# Altium schematic sheet Power Supplies.SchDoc: Power Supplies
size A4; SheetNumber: 5; SheetTotal: 5
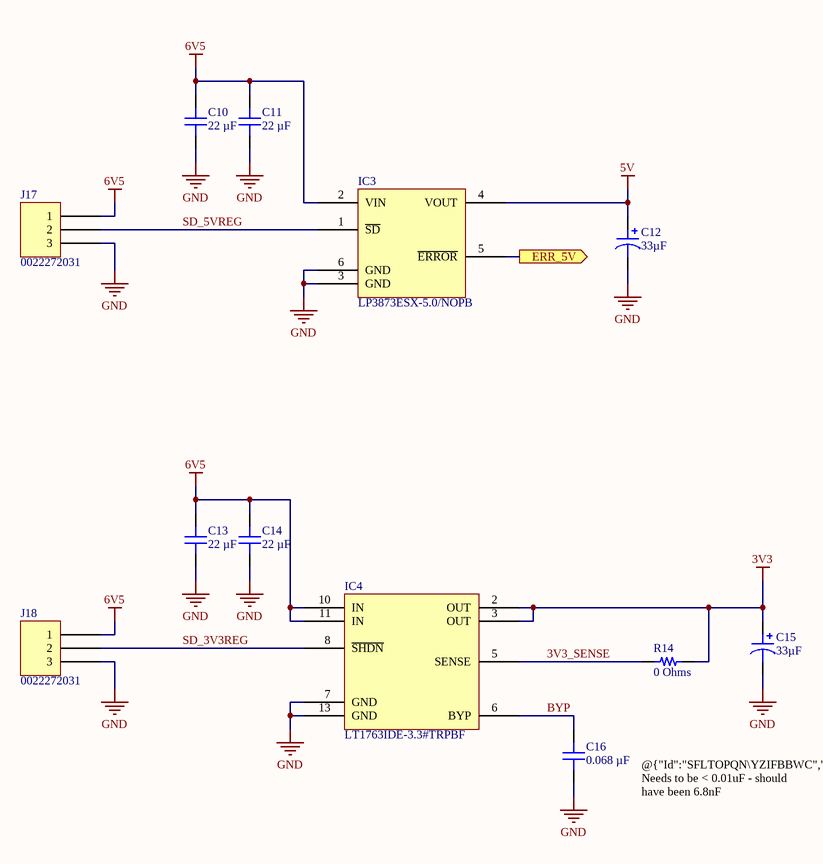
[diagram p0: Power Supplies.SchDoc]

## Parts
C10  22 µF  [CAP 1210_3225 - 1MM]
C11  22 µF  [CAP 1210_3225 - 1MM]
C12  33µF  [CAP POL 1411_3528]
C13  22 µF  [CAP 1210_3225 - 1MM]
C14  22 µF  [CAP 1210_3225 - 1MM]
C15  33µF  [CAP POL 1411_3528]
C16  0.068 µF  [CAP 0402_1005]
IC3  LP3873ESX-5.0/NOPB  [TI DDPAK-5 KTT R-PSFM-G5]
IC4  LT1763IDE-3.3#TRPBF  [ANALOG DFN-12 DE UE 05-08-1695 Rev D]
J17  0022272031  [MOLEX KK 0022272031]
J18  0022272031  [MOLEX KK 0022272031]
R14  0 Ohms  [RES 0603_1608]

## Ports
ERR_5V (out, see Overview[3D])

## Nets
3V3: C15.1 IC4.2(OUT) IC4.3(OUT) R14.1
5V: C12.1 IC3.4(VOUT)
6V5: C10.2 C11.2 C13.2 C14.2 IC3.2(VIN) IC4.10(IN) IC4.11(IN) J17.1 J18.1
GND: C10.1 C11.1 C12.2 C13.1 C14.1 C15.2 C16.1 IC3.3(GND) IC3.6(GND) IC4.7(GND) IC4.13(GND) J17.3 J18.3
3V3_SENSE: IC4.5(SENSE) R14.2
BYP: C16.2 IC4.6(BYP)
ERR_5V: IC3.5(~{ERROR}) ; port ERR_5V
SD_3V3REG: IC4.8(~{SHDN}) J18.2
SD_5VREG: IC3.1(~{SD}) J17.2

## Notes on the sheet
- @{"Id":"SFLTOPQN\YZIFBBWC","ObjectType":2} Needs to be < 0.01uF - should have been 6.8nF
- Title
- Size:
- Date:
- A4
- Number:
- Time:
- Revision:
- Sheet
- of
- File:

## Library data of the parts
C10 C11 C13 C14 = CL32B226KAJNNNE: CAP CER 22UF 25V X7R 1210; manufacturer: Samsung Electro-Mechanics; Tolerance: ±10%; Part Number: CL32B226KAJNNNE; Value: 22 µF; Applications: General Purpose; Capacitance: 22 µF; componentlink1description: Datasheet; componentlink1url: http://www.samsungsem.com/kr/support/product-search/mlcc/CL32B226KAJNNNE.jsp; componentlink2description: DigiKey Link; componentlink2url: https://www.digikey.com/en/products/detail/samsung-electro-mechanics/CL32B226KAJNNNE/3889050; Device Package: 1210 (3225 Metric); lastupdated: 11/03/2024 07:19:56; Lifecycle Status: Active; Minimum Order: 1; Mounting Type: Surface Mount, MLCC; Operating Temperature: -55°C ~ 125°C; Package / Case: 1210 (3225 Metric); packaging: TapeAndReel; partid: 39957; Part Status: Active; price: 0.13; series: CL; Size / Dimension: 0.126" L x 0.098" W (3.20mm x 2.50mm); Supplier 1: DigiKey; Supplier Part Number 1: 1276-3392-1-ND; Temperature Coefficient: X7R; Thickness (Max): 0.106" (2.70mm); Voltage - Rated: 25V
C12 C15 = TAJB336K016RNJ: CAP TANT 33UF 10% 16V 1411; manufacturer: AVX Corporation; Manufacturer Size Code: B; ESR (Equivalent Series Resistance): 2.1Ohm; Type: Molded; Part Number: TAJB336K016RNJ; Value: 33µF; Capacitance: 33µF; componentlink1description: Datasheet; componentlink1url: http://datasheets.avx.com/TAJ.pdf; componentlink2description: DigiKey Link; componentlink2url: http://digikey.com/product-detail/en/avx-corporation/TAJB336K016RNJ/478-1688-1-ND/564720; Features: General Purpose; Height - Seated (Max): 0.083" (2.10mm); lastupdated: 02/09/2020 01:15:43; Lifecycle Status: Active; Minimum Order: 1; Mounting Type: Surface Mount; Operating Temperature: -55°C ~ 125°C; Package / Case: 1411 (3528 Metric), 1210; packaging: TapeAndReel; partid: 928; Part Status: Active; price: 0.28; series: TAJ; Size / Dimension: 0.138" L x 0.110" W (3.50mm x 2.80mm); Supplier 1: DigiKey; Supplier Part Number 1: 478-1688-1-ND; Tolerance: ±10%; Voltage - Rated: 16V
C16 = GCM155R71H683KE02D: CAP CER 0.068UF 50V X7R 0402; manufacturer: Murata Electronics; Tolerance: ±10%; Part Number: GCM155R71H683KE02D; Value: 0.068 µF; Applications: Automotive; Capacitance: 0.068 µF; componentlink1description: Datasheet; componentlink1url: https://search.murata.co.jp/Ceramy/image/img/A01X/G101/ENG/GCM155R71H683KE02-01.pdf; componentlink2description: DigiKey Link; componentlink2url: https://www.digikey.com/en/products/detail/murata-electronics/GCM155R71H683KE02D/4903710; Device Package: 0402 (1005 Metric); lastupdated: 09/02/2024 20:04:22; Lifecycle Status: Active; Minimum Order: 1; Mounting Type: Surface Mount, MLCC; Operating Temperature: -55°C ~ 125°C; Package / Case: 0402 (1005 Metric); packaging: TapeAndReel; partid: 11488; Part Status: Active; price: 0.01; Ratings: AEC-Q200; series: GCM; Size / Dimension: 0.039" L x 0.020" W (1.00mm x 0.50mm); Supplier 1: DigiKey; Supplier Part Number 1: 490-14516-1-ND; Temperature Coefficient: X7R; Thickness (Max): 0.022" (0.55mm); Voltage - Rated: 50V
IC3 = LP3873ESX-5.0/NOPB: IC REG LIN 5V 3A DDPAK/TO263-5; Manufacturer: Texas Instruments; Control Features: Enable; Current - Quiescent (Iq): 9 mA; Current - Supply (Max): 15 mA; Number of Regulators: 1; Output Configuration: Positive; Output Type: Fixed; Protection Features: Over Current, Over Temperature, Short Circuit; PSRR: 73dB ~ 57dB (120Hz); Voltage Dropout (Max): 1.2V @ 3A; Voltage - Input (Max): 7V; Part Number: LP3873ESX-5.0/NOPB; ComponentLink1Description: Datasheet; ComponentLink1URL: https://www.ti.com/general/docs/suppproductinfo.tsp?distId=10&gotoUrl=https%3A%2F%2Fwww.ti.com%2Flit%2Fgpn%2Flp3876; ComponentLink2Description: DigiKey Link; ComponentLink2URL: https://www.digikey.com/en/products/detail/texas-instruments/LP3873ESX-5-0-NOPB/1872700; Current - Output: 3A; LastUpdated: 16/03/2024 19:51:05; Lifecycle Status: Active; Minimum Order: 1; Mounting Type: Surface Mount; Operating Temperature: -40°C ~ 125°C; Packaging: TapeAndReel; Part Status: Active; Price: 2.83; Series: -; Supplier 1: DigiKey; Supplier Part Number 1: 296-LP3873ESX-5.0/NOPBCT-ND; Supplier Device Package: TO-263 (DDPAK-5); Voltage - Output (Min/Fixed): 5V
IC4 = LT1763IDE-3.3#TRPBF: IC REG LINEAR 3.3V 500MA 12DFN; Manufacturer: Analog Devices Inc.; Control Features: Enable; Number of Regulators: 1; Output Configuration: Positive; Output Type: Fixed; Protection Features: Over Current, Over Temperature, Reverse Polarity; PSRR: 65dB (120Hz); Voltage Dropout (Max): 0.45V @ 500mA; Voltage - Input (Max): 20V; Part Number: LT1763IDE-3.3#TRPBF; ComponentLink1Description: Datasheet; ComponentLink1URL: https://www.analog.com/media/en/technical-documentation/data-sheets/1763fh.pdf; ComponentLink2Description: DigiKey Link; ComponentLink2URL: https://www.digikey.com/en/products/detail/analog-devices-inc/LT1763IDE-3-3-TRPBF/2181278; Current - Output: 500mA; LastUpdated: 17/03/2024 15:16:57; Lifecycle Status: Active; Minimum Order: 1; Mounting Type: Surface Mount; Operating Temperature: -40°C ~ 125°C; Packaging: TapeAndReel; Part Status: Active; Price: 4.11; Series: -; Supplier 1: DigiKey; Supplier Part Number 1: LT1763IDE-3.3#TRPBFCT-ND; Supplier Device Package: 12-DFN (4x3); Voltage - Output (Min/Fixed): 3.3V
J17 J18 = 0022272031: CONN HEADER VERT 3POS 2.54MM; Manufacturer: Molex; Contact Length - Mating: 0.295" (7.49mm); Contact Length - Post: 0.140" (3.56mm); Material Flammability Rating: UL94 V-0; Number of Positions: 3; Number of Positions Loaded: All; Overall Contact Length: 0.560" (14.22mm); Pitch - Mating: 0.100" (2.54mm); Shrouding: Shrouded - 1 Wall; Style: Board to Cable/Wire; Part Number: 0022272031; ComponentLink1Description: Datasheet; ComponentLink1URL: https://www.molex.com/pdm_docs/sd/022272031_sd.pdf; ComponentLink2Description: DigiKey Link; ComponentLink2URL: http://digikey.com/product-detail/en/molex/0022272031/WM4112-ND/1130578; Connector Type: Header; Contact Finish - Mating: Tin; Contact Finish - Post: Tin; Contact Finish Thickness - Mating: 100.0µin (2.54µm); Contact Material: Brass; Contact Shape: Square; Contact Type: Male Pin; Fastening Type: Friction Lock; Insulation Color: Natural; Insulation Height: 0.461" (11.70mm); Insulation Material: Polyamide (PA), Nylon; LastUpdated: 12/01/2020 23:51:54; Lifecycle Status: Active; Minimum Order: 1; Mounting Type: Through Hole; Number of Rows: 1; Packaging: Bulk; PartId: 77; Part Status: Active; Price: 0.37; Series: KK 6410; Supplier 1: DigiKey; Supplier Part Number 1: WM4112-ND; Termination: Solder
R14 = ERJ-3GEY0R00V: RES SMD 0 OHM JUMPER 1/10W 0603; Manufacturer: Panasonic Electronic Components; Power (Watts): 0.1W, 1/10W; Part Number: ERJ-3GEY0R00V; Value: 0 Ohms; ComponentLink1Description: Datasheet; ComponentLink1URL: http://industrial.panasonic.com/www-cgi/jvcr13pz.cgi?E+PZ+3+AOA0001+ERJ3GEY0R00V+7+WW; ComponentLink2Description: DigiKey Link; ComponentLink2URL: https://www.digikey.com/en/products/detail/panasonic-electronic-components/ERJ-3GEY0R00V/135656; Composition: Thick Film; Device Package: 0603 (1608 Metric); Features: Automotive AEC-Q200; Height - Seated (Max): 0.022" (0.55mm); LastUpdated: 09/02/2024 20:42:26; Lifecycle Status: Active; Minimum Order: 1; Number of Terminations: 2; Operating Temperature: -55°C ~ 155°C; Package / Case: 0603 (1608 Metric); Packaging: CutTape; PartId: 22603; Part Status: Active; Price: 0.01; Ratings: AEC-Q200; Resistance: 0 Ohms; Series: ERJ-3G; Size / Dimension: 0.063" L x 0.031" W (1.60mm x 0.80mm); Supplier 1: DigiKey; Supplier Part Number 1: P0.0GCT-ND; Supplier Device Package: 0603; Tolerance: Jumper